# EAGLE design breakout_board (EAGLE 7.2.0)
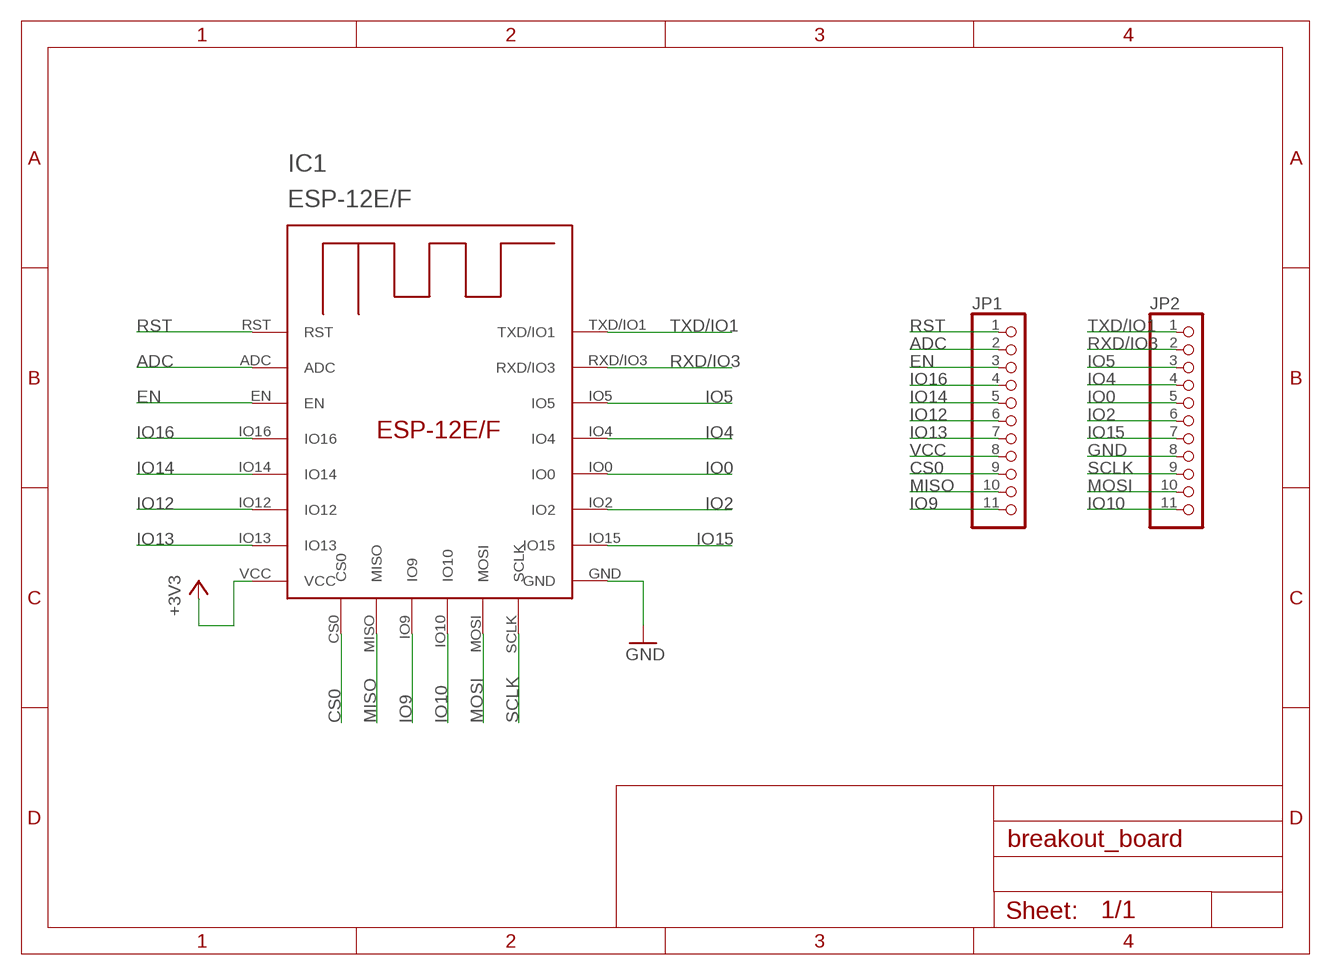
[diagram p0: schematic, sheet 1]

## Parts
IC1  ESP-12E/F  [ESP-12E]
JP1  PINHD-1X11  [1X11]
JP2  PINHD-1X11  [1X11]

## Nets
ADC: IC1.ADC JP1.2
CS0: IC1.CS0 JP1.9
EN: IC1.EN JP1.3
GND: IC1.GND JP2.8
IO0: IC1.IO0 JP2.5
IO2: IC1.IO2 JP2.6
IO4: IC1.IO4 JP2.4
IO5: IC1.IO5 JP2.3
IO9: IC1.IO9 JP1.11
IO10: IC1.IO10 JP2.11
IO12: IC1.IO12 JP1.6
IO13: IC1.IO13 JP1.7
IO14: IC1.IO14 JP1.5
IO15: IC1.IO15 JP2.7
IO16: IC1.IO16 JP1.4
MISO: IC1.MISO JP1.10
MOSI: IC1.MOSI JP2.10
RST: IC1.RST JP1.1
RXD/IO3: IC1.RXD/IO3 JP2.2
SCLK: IC1.SCLK JP2.9
TXD/IO1: IC1.TXD/IO1 JP2.1
VCC: IC1.VCC JP1.8 ; supply symbol labelled +3V3

## Library data of the parts
IC1 = esp-12e-f:ESP-12E/F
JP1 JP2 = pinhead:PINHD-1X11: PIN HEADER

## Board
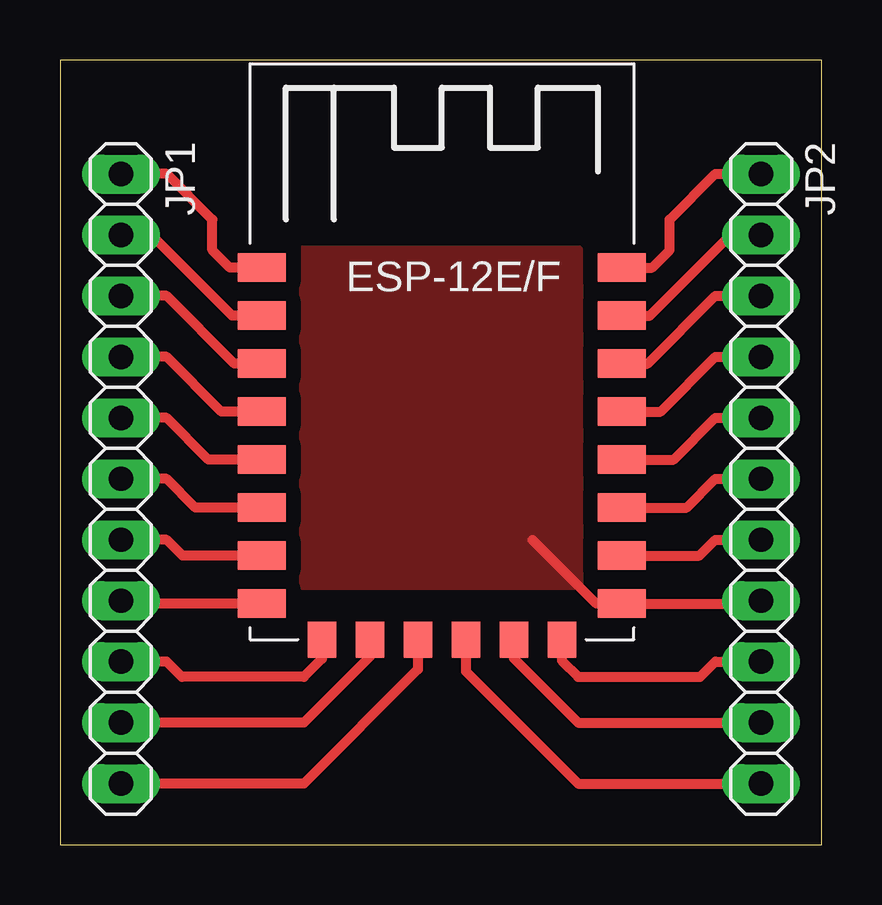
[diagram p1: board, top side]

Size 31.73 x 32.69 mm. Coordinates in mm from the lower left corner, seen from the top.
Outline: 0,0 31.73,0 31.73,32.69 0,32.69 0,0
Copper layers (1*16): Top 0.035mm / dielectric 1.5mm / Bottom 0.035mm
Design rules "SparkFun": minimum track width 8mil, minimum drill 20mil, track to track 8mil, track to pad 8mil, pad to pad 8mil, via to via 8mil, smd to smd 8mil, copper to edge 10mil, drill to drill 8mil, minimum pad ring 12mil, minimum via ring 10mil, stop-mask expansion 4mil, vias tented up to drill 25mil, thermal gap 10mil

### Footprints (pad centres in the part's own frame; a part is rotated, then mirrored left to right if it is on the bottom)
ESP-12E = smd 2 x 1.2: ADC -7.46,5.53; EN -7.46,3.53; GND 7.54,-6.47; IO0 7.54,-0.47; IO2 7.54,-2.47; IO4 7.54,1.53; IO5 7.54,3.53; IO12 -7.46,-2.47; IO13 -7.46,-4.47; IO14 -7.46,-0.47; IO15 7.54,-4.47; IO16 -7.46,1.53; RST -7.46,7.53; RXD/IO3 7.54,5.53; TXD/IO1 7.54,7.53; VCC -7.46,-6.47 | smd 1.2 x 1.5: CS0 -4.96,-7.97; IO9 -0.96,-7.97; IO10 1.04,-7.97; MISO -2.96,-7.97; MOSI 3.04,-7.97; SCLK 5.04,-7.97
1X11 = drill 1.016 long: 1 -12.7,0; 2 -10.16,0; 3 -7.62,0; 4 -5.08,0; 5 -2.54,0; 6 0,0; 7 2.54,0; 8 5.08,0; 9 7.62,0; 10 10.16,0; 11 12.7,0

### Placement (x,y rotation side)
IC1  15.88,16.51 0 top
JP1  2.54,15.24 270 top
JP2  29.21,15.24 270 top

### Tracks (layer width: path | path; a pad name or v marks a point on that pad's centre or on a via)
ADC
  Top 0.406: IC1.ADC 7.17,22.04 3.81,25.4 JP1.2
CS0
  Top 0.406: IC1.CS0 10.91,7.74 10.16,6.99 5.08,6.99 4.45,7.62 JP1.9
EN
  Top 0.406: IC1.EN 7.26,20.04 4.45,22.86 JP1.3
GND
  Top 0.406: JP2.8 29.09,10.04 IC1.GND 22.34,10.04 19.68,12.7
  pour Top (isolate 0.61): 10.16,24.77 21.59,24.77 21.59,10.79 10.16,10.79
IO0
  Top 0.406: IC1.IO0 25.57,16.04 27.3,17.78 JP2.5
IO2
  Top 0.406: IC1.IO2 26.11,14.04 27.3,15.24 JP2.6
IO4
  Top 0.406: IC1.IO4 25.02,18.04 27.3,20.32 JP2.4
IO5
  Top 0.406: IC1.IO5 24.48,20.04 27.3,22.86 JP2.3
IO9
  Top 0.406: IC1.IO9 14.91,7.29 10.16,2.54 JP1.11
IO10
  Top 0.406: IC1.IO10 16.91,7.21 21.59,2.54 JP2.11
IO12
  Top 0.406: IC1.IO12 5.64,14.04 4.45,15.24 JP1.6
IO13
  Top 0.406: IC1.IO13 5.11,12.04 4.45,12.7 JP1.7
IO14
  Top 0.406: IC1.IO14 6.18,16.04 4.45,17.78 JP1.5
IO15
  Top 0.406: IC1.IO15 26.64,12.04 27.3,12.7 JP2.7
IO16
  Top 0.406: IC1.IO16 6.72,18.04 4.45,20.32 JP1.4
MISO
  Top 0.406: IC1.MISO 12.91,7.83 10.16,5.08 JP1.10
MOSI
  Top 0.406: IC1.MOSI 18.91,7.75 21.59,5.08 JP2.10
RST
  Top 0.406: IC1.RST 7.08,24.04 6.35,24.77 6.35,26.04 4.45,27.94 JP1.1
RXD/IO3
  Top 0.406: IC1.RXD/IO3 24.58,22.04 27.94,25.4 JP2.2
SCLK
  Top 0.406: IC1.SCLK 20.91,7.66 21.59,6.99 26.67,6.99 27.3,7.62 JP2.9
TXD/IO1
  Top 0.406: IC1.TXD/IO1 24.68,24.04 25.4,24.77 25.4,26.04 27.3,27.94 JP2.1
VCC
  Top 0.406: IC1.VCC 2.66,10.04 JP1.8